# Altium schematic sheet CEA2045.SchDoc: CEA2045 Interface
size A; Author: Craig Hesling; DrawnBy: Craig Hesling; Revision: 2
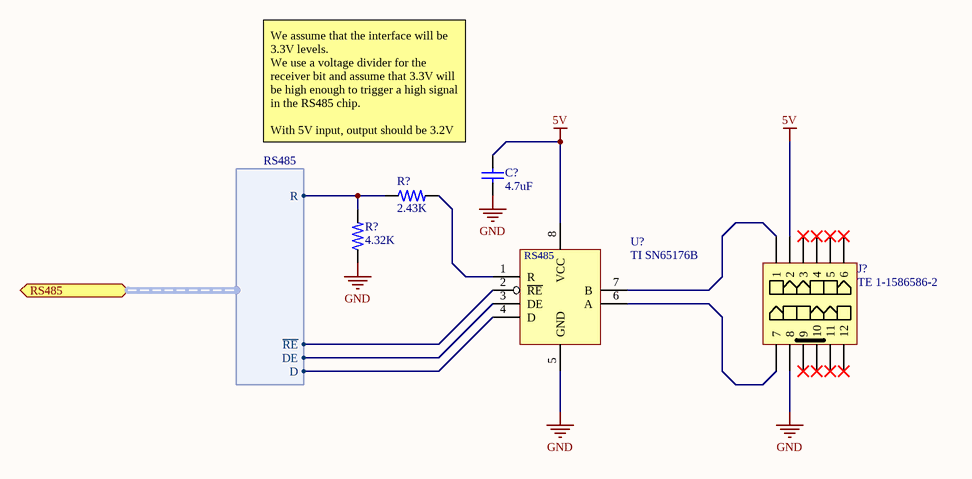
[diagram p0: CEA2045.SchDoc]

## Parts
(Parts that share a designator on the sheet are numbered #1, #2 ... from top to bottom, then left to right.)
C?  4.7uF  [CAPC1608X09L - CAP0603]
J?  TE 1-1586586-2  [12POS 4.2mm Pitch Vertical]
R?#1  2.43K  [RESC1608X06L - RES0603]
R?#2  4.32K  [RESC1608X06L - RES0603]
U?  TI SN65176B  [SOIC127P600X175-8L]

## Ports
RS485 (harness RS485)

## Harnesses
RS485: R, ~{RE}, DE, D

## Nets
5V: C?.2 J?.2 U?.8(VCC)
GND: C?.1 J?.8 R?#2.1 U?.5(GND)
NetJ?_1: J?.1 U?.7(B)
NetJ?_7: J?.7 U?.6(A)
NetR?#1_1: R?#1.1 R?#2.2 ; port RS485.R
NetR?#1_2: R?#1.2 U?.1(R)
NetU?_2: U?.2(~{RE}) ; port RS485.~{RE}
NetU?_3: U?.3(DE) ; port RS485.DE
NetU?_4: U?.4(D) ; port RS485.D

Not connected (* = marked no-connect by the designer): J? 3* 4* 5* 6* 9* 10* 11* 12*

## Notes on the sheet
- We assume that the interface will be 3.3V levels.
  We use a voltage divider for the receiver bit and assume that 3.3V will be high enough to trigger a high signal in the RS485 chip.
  With 5V input, output should be 3.2V at 0A
- (in symbol SN65176B) RS485

## Library data of the parts
C? = CAP0603 4.7uF 10% 6.3V X7R: SMT 0603 Ceramic Capacitor; TempCoeff: X7R; Tolerance: 10%; Voltage: 6.3V; Value: 4.7uF; Supplier 1: Digi-Key; Supplier Part Number 1: 1276-2087-1-ND
J? = 12POS 4.2mm Pitch Vertical: TE Connectivity 1-1586586-2; Supplier 1: Allied; Supplier 2: Digi-Key; Supplier Part Number 1: 70041598; Supplier Part Number 2: 1-1586586-2-ND
R?#1 = RES0603 2.43K 1% 1/10W: SMT 0603 Ceramic Resistor; Power: 1/10W; Tolerance: 1%; Value: 2.43K; Supplier 1: Digi-Key; Supplier 2: Mouser; Supplier Part Number 1: 311-2.43KHRDKR-ND; Supplier Part Number 2: 603-RC0603FR-072K43L
R?#2 = RES0603 4.32K 1% 1/10W: SMT 0603 Ceramic Resistor; Power: 1/10W; Tolerance: 1%; Value: 4.32K; Supplier 1: Digi-Key; Supplier 2: Digi-Key; Supplier 3: Digi-Key; Supplier Part Number 1: 311-4.32KHRTR-ND; Supplier Part Number 2: P4.32KHCT-ND; Supplier Part Number 3: CRCW06034K32FKEB-ND
U? = SN65176B: Half Duplex RS485 Tranceiver; Supplier 1: Digi-Key; Supplier 2: Mouser; Supplier Part Number 1: 296-14636-1-ND; Supplier Part Number 2: 595-SN65176BDR